# EasyEDA Pro project ProPrj_table-monitor_2025-05-22.epro, schematic Schematic2
Board Name: MipiBoard; Create Date: 2025-04-22; Page Name: P1; Project Name: table-monitor; Schematic Name: Schematic2; Update Date: 2025-04-25; Company: 嘉立创EDA; Page Size: A4; Version: V1.0
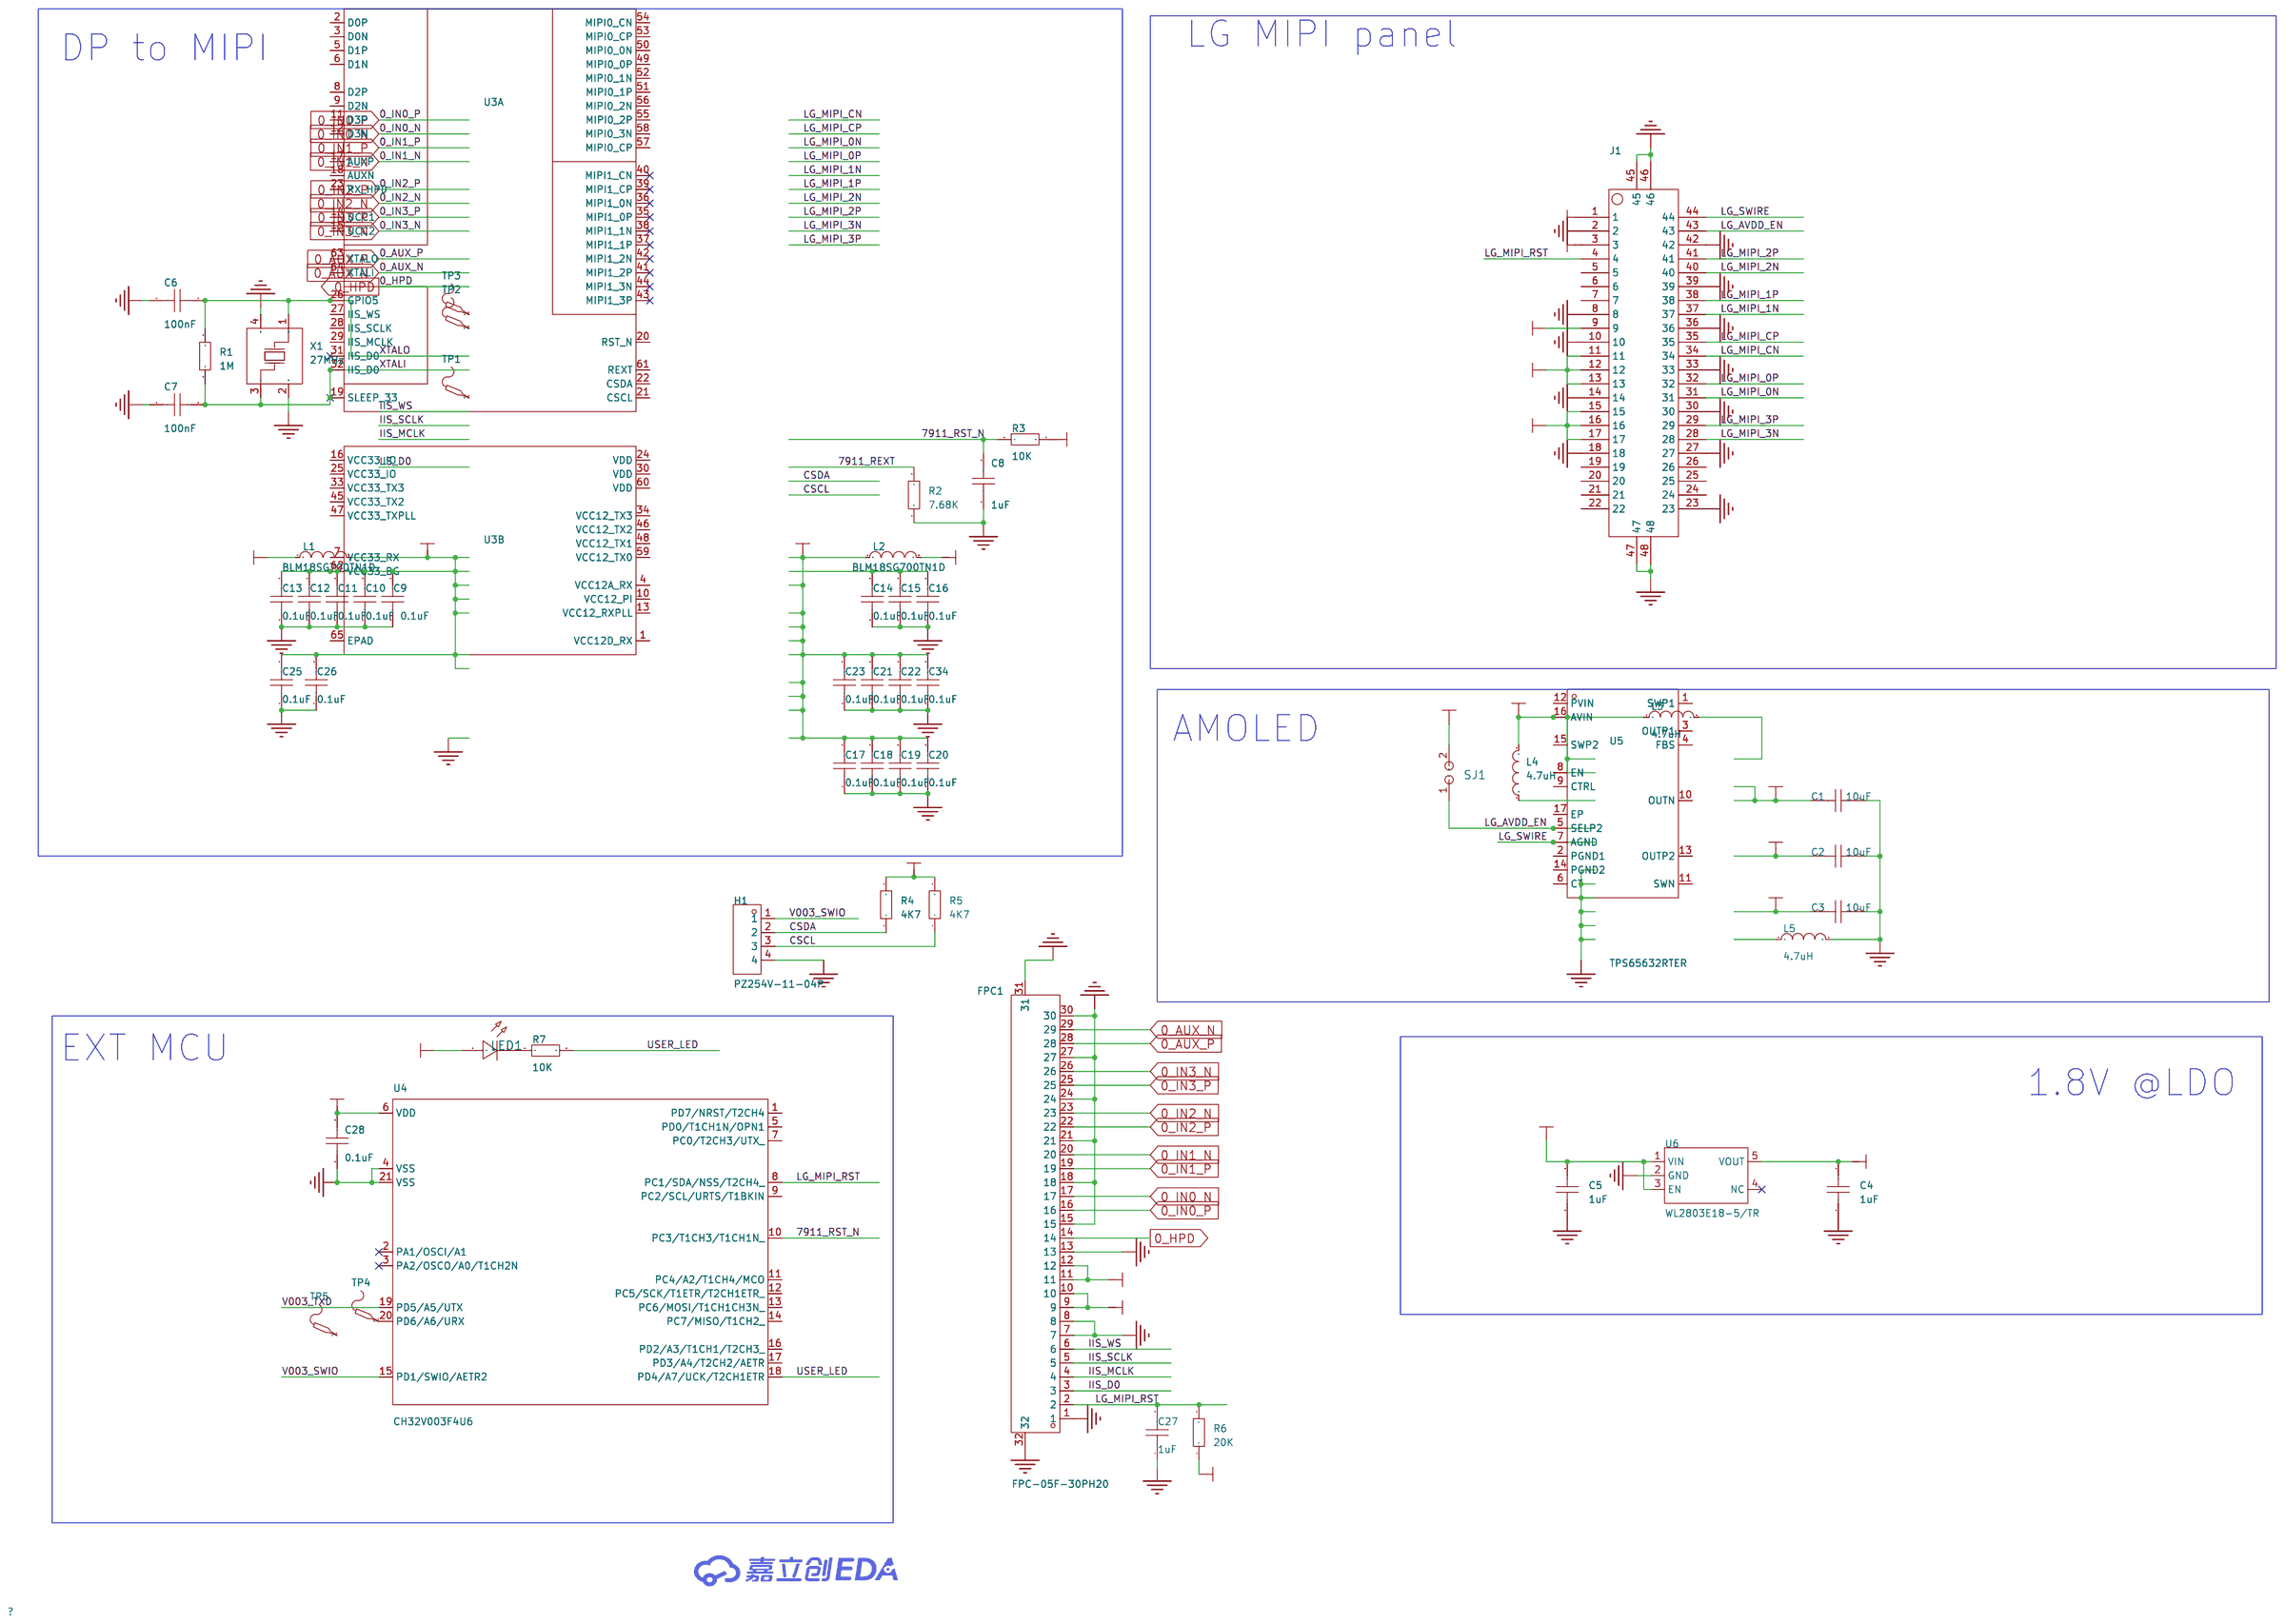
[diagram p0: schematic sheet]

## Parts
C1  10uF  [C0603]
C2  10uF  [C0603]
C3  10uF  [C0603]
C4  1uF  [C0603]
C5  1uF  [C0603]
C6  100nF  [C0603]
C7  100nF  [C0603]
C8  1uF  [C0603]
C9  0.1uF  [C0603]
C10  0.1uF  [C0603]
C11  0.1uF  [C0603]
C12  0.1uF  [C0603]
C13  0.1uF  [C0603]
C14  0.1uF  [C0603]
C15  0.1uF  [C0603]
C16  0.1uF  [C0603]
C17  0.1uF  [C0603]
C18  0.1uF  [C0603]
C19  0.1uF  [C0603]
C20  0.1uF  [C0603]
C21  0.1uF  [C0603]
C22  0.1uF  [C0603]
C23  0.1uF  [C0603]
C25  0.1uF  [C0603]
C26  0.1uF  [C0603]
C27  1uF  [C0603]
C28  0.1uF  [C0603]
C34  0.1uF  [C0603]
FPC1  FPC-05F-30PH20  [FPC-SMD_30P-P0.50_XUNPU_FPC-05F-30PH20]
H1  PZ254V-11-04P  [HDR-TH_4P-P2.54-V-M]
J1  -  [CONN-SMD_BM23PF0.8-44DS-0.35V]
L1  BLM18SG700TN1D  [L0603]
L2  BLM18SG700TN1D  [L0603]
L3  4.7uH  [IND-SMD_L2.5-W2.0]
L4  4.7uH  [IND-SMD_L2.5-W2.0]
L5  4.7uH  [IND-SMD_L2.5-W2.0]
LED1  -  [LED_0603]
R1  1M  [R0603]
R2  7.68K  [R0603]
R3  10K  [R0603]
R4  4K7  [R0603]
R5  4K7  [R0603]
R6  20K  [R0603]
R7  10K  [R0603]
SJ1  -  [TOGO_MODE]
TP1  -  [Test-Point-0.5mm]
TP2  -  [Test-Point-0.5mm]
TP3  -  [Test-Point-0.5mm]
TP4  -  [Test-Point-0.5mm]
TP5  -  [Test-Point-0.5mm]
U3  -  [QFN-64_L7.5-W7.5-P0.40]  (sections 1,2)
U4  CH32V003F4U6  [QFN-20_L3.0-W3.0-P0.40-TL-EP1.7]
U5  TPS65632RTER  [WQFN-16_L3.0-W3.0-P0.50-BL-EP1.7]
U6  WL2803E18-5/TR  [TSOT-23-5_L2.9-W1.6-P0.95-LS2.8-BR]
X1  27MHz  [OSC-SMD_4P-L3.2-W2.5-BL]

## Library data of the parts
C1-C23 C25-C28 C34 = CAP_0603: Supplier Footprint: 0603
FPC1 = FPC-05F-30PH20: 锁定特性:翻盖式;触点类型:下接;触点数量:30P;间距:0.5mm;安装类型:卧贴;工作温度范围:-25℃~+85℃;; LCSC Part Name: 间距:0.5mm P数:30P 翻盖式 下接; Supplier Part: C2856808; Manufacturer: XUNPU(讯普); Supplier Footprint: SMD,P=0.5mm,卧贴; JLCPCB Part Class: Extended Part; Datasheet: https://atta.szlcsc.com/upload/public/pdf/source/20210922/C2856808_4E6DDE2793CFD9EF09B771A8BD3338A4.pdf; Supplier: LCSC; Locking Feature: 翻盖式; Contact Type: 下接; Number of Contacts: 30P; Pitch: 0.5mm; Mounting Type: 卧贴; FFC, FCB Thickness: 0.3mm; Height Above Board: 2mm; Operating Temperature Range: -25℃~+85℃
H1 = PZ254V-11-04P: 插针结构:1x4P;间距:2.54mm;行距:-;圆针/方针:方针;安装类型:直插;排数:单排;总PIN位数:4P;额定电流:3A;额定电压:250V;配合针长度:6mm;塑高:2.5mm;端接针长度:3mm;触头材质:-;工作温度范围:-40℃~+105℃;颜色:黑色;; LCSC Part Name: 间距:2.54mm 1x4P 直插 方针; Supplier Part: C2691448; Manufacturer: XFCN(兴飞); Supplier Footprint: 插件,P=2.54mm; JLCPCB Part Class: 扩展库; Datasheet: https://atta.szlcsc.com/upload/public/pdf/source/20200309/C492403_F9F19131791D08044AD4F84F8E751A34.pdf; Supplier: LCSC; Pin Structure: 1x4P; Pitch: 2.54mm; Circluar Pins/Square Pins: 方针; Mounting Type: 直插; Number of Rows: 单排; Number of Pins: 4P; Current Rating (Max): 3A; Voltage Rating (Max): 250V; Length of Mating Pin: 6mm; Insulation Height: 2.5mm; Length of End Connection Pin: 3mm; Operating Temperature Range: -40℃~+105℃; Color: 黑色
J1 = BM23PF0.8-44DS-0.35V
L1 L2 = BLM18SG700TN1D: 标称阻抗@测试频率:70Ω@100MHz;误差:±25%;直流电阻(RDC):20mΩ;; LCSC Part Name: 单路 0603磁珠 阻抗70Ω@100MHz; Supplier Part: C113031; Manufacturer: muRata(村田); Supplier Footprint: 0603; JLCPCB Part Class: 扩展库; Datasheet: https://atta.szlcsc.com/upload/public/pdf/source/20170523/1495533956547.pdf; Supplier: LCSC; Impedance @ Frequency: 70Ω@100MHz; Tolerance: ±25%; DC Resistance: 20mΩ; Current Rating: 4A; Circuits: 1
L3-L5 = MCS25GD-4R7MMP: 电感值:4.7uH;精度:±20%;额定电流:1.4A;; LCSC Part Name: 4.7uH ±20%; Supplier Part: C443497; Manufacturer: PSA(信昌电陶); Supplier Footprint: SMD; JLCPCB Part Class: 扩展库; Datasheet: https://atta.szlcsc.com/upload/public/pdf/source/20191104/C443497_E5D87B1181E64B5D627F31A1536527C6.pdf; Supplier: LCSC; Tolerance: ±20%; Rated Current: 1.4A; DC Resistance (DCR): 196mΩ
LED1 = LED_0603-R: Supplier Footprint: 0603
R1-R7 = Res_0603: Supplier Footprint: 0603
SJ1 = JUMP跳接焊盘选择: Pin Type: IN
TP1-TP5 = Test-Point: Test Point 测试点
U3 = LT7911D
U4 = CH32V003F4U6: CPU内核:RISC-V;程序存储容量:16KB;RAM总容量:2KB;GPIO端口数量:18;工作电压范围:-;CPU最大主频:48MHz;程序存储器类型:-;应用领域:-;; Supplier Part: C5299908; Manufacturer: WCH(南京沁恒); Supplier Footprint: QFN-20(3X3); JLCPCB Part Class: Extended Part; Datasheet: https://atta.szlcsc.com/upload/public/pdf/source/20240313/77CE2EF5E2A3AF5A92256F1D84EF4244.pdf; Supplier: LCSC; CPU Core: RISC-V; Program Storage Size: 16KB; RAM Size: 2KB; GPIO Ports Number: 18; CPU Maximum Speed: 48MHz; UART/USART: 1; I2C: 1; SPI: 1; Watchdog: 有; Real-Time Clock: 有
U5 = TPS65632: Supplier Part: C2659312; Manufacturer: TI(德州仪器); Supplier Footprint: WQFN-16; JLCPCB Part Class: Extended Part; Datasheet: https://atta.szlcsc.comnull; Supplier: LCSC
U6 = WL2803E18-5/TR: 输出类型:固定;工作电压:5.5V;输出电压:1.8V;输出电流:-;电源纹波抑制比(PSRR):65dB@(1kHz)；58dB@(10kHz);输出极性:正极;; LCSC Part Name: 输入5.5V 输出1.8V; Supplier Part: C467850; Manufacturer: WILLSEMI(韦尔); Supplier Footprint: SOT-23-5L; JLCPCB Part Class: 扩展库; Datasheet: https://atta.szlcsc.com/upload/public/pdf/source/20191209/C467850_7EB67D2C8B50A7F5BE22250846E38DD9.pdf; Supplier: LCSC; Output Type: 固定; Voltage - Supply: 5.5V; Output Voltage: 1.8V; Power Supply Rejection Ratio (PSRR): 65dB@(1kHz)；58dB@(10kHz); Voltage Dropout: 230mV@(500mA); Features: 防静电保护；热保护(TSD)；过流保护(OCP)；带使能; Output Configuration: 正极; Number of Outputs: 1
X1 = X322527MSB4SI: 晶振类型:贴片晶振;频率:27MHz;常温频差:±10ppm;外接负载电容:20pF;频率稳定度(全温):±20ppm;; LCSC Part Name: 27MHz ±10ppm 20pF; Supplier Part: C9008; Manufacturer: YXC(扬兴晶振); Supplier Footprint: SMD3225-4P; JLCPCB Part Class: Extended Part; Datasheet: https://atta.szlcsc.com/upload/public/pdf/source/20240329/19D5F850207469550BEB00D7DFEDBC7A.pdf; Supplier: LCSC; Crystal Type: 贴片晶振; Normal temperature Frequency Tolerance: ±10ppm; External load capacitor: 20pF; Frequency Stability(Full temperature range): ±20ppm; Operating Temperature: -40℃~+85℃

## Nets
GND: C1.2 C2.2 C3.2 C4.1 C5.1 C6.1 C7.1 C8.1 C9.1 C10.1 C11.1 C12.1 C13.1 C14.1 C15.1 C16.1 C17.1 C18.1 C19.1 C20.1 C21.1 C22.1 C23.1 C25.1 C26.1 C27.1 C28.1 C34.1 FPC1.1 FPC1.7 FPC1.8 FPC1.13 FPC1.15 FPC1.18 FPC1.21 FPC1.24 FPC1.27 FPC1.30 FPC1.31 FPC1.32 H1.4 J1.2 J1.8 J1.10 J1.14 J1.18 J1.23 J1.27 J1.30 J1.33 J1.36 J1.39 J1.42 J1.45 J1.46 J1.47 J1.48 L5.2 R2.1 U4.4(VSS) U4.21(VSS) U6.2(GND) X1.2(GND) X1.4(GND)
V003_SWIO: H1.1 U4.15(PD1/SWIO/AETR2)
V003_TXD: U4.19(PD5/A5/UTX)
V33S: C5.2 C28.2 FPC1.11 FPC1.12 J1.1 L1.1 L3.1 L4.2 LED1.2(A) R3.2 R4.2 R5.2 R6.1 SJ1.2 U4.6(VDD) U5.16(AVIN) U6.1(VIN) U6.3(EN)
0_AUX_N: FPC1.29
0_AUX_P: FPC1.28
0_HPD: FPC1.14
0_IN0_N: FPC1.17
0_IN0_P: FPC1.16
0_IN1_N: FPC1.20
0_IN1_P: FPC1.19
0_IN2_N: FPC1.23
0_IN2_P: FPC1.22
0_IN3_N: FPC1.26
0_IN3_P: FPC1.25
7911_REXT: R2.2
7911_RST_N: C8.2 R3.1 U4.10(PC3/T1CH3/T1CH1N_)
7911_V12: FPC1.9 FPC1.10 L2.2
#7911_V3: C9.2 C10.2 C11.2 C12.2 C13.2 C25.2 C26.2 L1.2 U3.62(VCC33_BG)
#7911_V12: C17.2 C18.2 C19.2 C20.2 C21.2 C22.2 C23.2 C34.2 L2.1
CSCL: H1.3 R5.1
CSDA: H1.2 R4.1
IIS_D0: FPC1.3
IIS_MCLK: FPC1.4
IIS_SCLK: FPC1.5
IIS_WS: FPC1.6
LG_AVDD: C3.1 J1.9
LG_AVDD_EN: J1.43 SJ1.1 U5.5(SELP2)
LG_MIPI_0N: J1.31
LG_MIPI_0P: J1.32
LG_MIPI_1N: J1.37
LG_MIPI_1P: J1.38
LG_MIPI_2N: J1.40
LG_MIPI_2P: J1.41
LG_MIPI_3N: J1.28
LG_MIPI_3P: J1.29
LG_MIPI_CN: J1.34
LG_MIPI_CP: J1.35
LG_MIPI_RST: C27.2 FPC1.2 J1.4 R6.2 U4.8(PC1/SDA/NSS/T2CH4_)
LG_SWIRE: J1.44 U5.7(AGND)
LG_V18: C4.2 J1.3 U6.5(VOUT)
LG_VDD: C1.1 J1.11 J1.12 J1.13
LG_VSS: C2.1 J1.15 J1.16 J1.17
USER_LED: R7.2 U4.18(PD4/A7/UCK/T2CH1ETR)
XTALI: C7.2 R1.1 U3.19(SLEEP_33) U3.32(IIS_D0) X1.3(OSC2)
XTALO: C6.2 R1.2 U3.26(GPIO5) X1.1(OSC1)
Net-(C14-2): C14.2 C15.2 C16.2
Net-(LED1-1): LED1.1(C) R7.1
Net-(TP4-1): TP4.1 U4.20(PD6/A6/URX)

Not connected (* = marked no-connect by the designer): J1 5 6 7 19 20 21 22 24 25 26; L3 2; L4 1; L5 1; TP1 1; TP2 1; TP3 1; TP5 1; U3 1(VCC12D_RX) 2(D0P) 3(D0N) 4(VCC12A_RX) 5(D1P) 6(D1N) 7(VCC33_RX) 8(D2P) 9(D2N) 10(VCC12_PI) 11(D3P) 12(D3N) 13(VCC12_RXPLL) 14(UCC1) 15(UCC2) 16(VCC33_IO) 17(AUXP) 18(AUXN) 20(RST_N) 21(CSCL) 22(CSDA) 23(RX_HPD) 24(VDD) 25(VCC33_IO) 27(IIS_WS) 28(IIS_SCLK) 29(IIS_MCLK) 30(VDD) 31(IIS_D0)* 33(VCC33_TX3) 34(VCC12_TX3) 35(MIPI1_0P)* 36(MIPI1_0N)* 37(MIPI1_1P)* 38(MIPI1_1N)* 39(MIPI1_CP)* 40(MIPI1_CN)* 41(MIPI1_2P)* 42(MIPI1_2N)* 43(MIPI1_3P)* 44(MIPI1_3N)* 45(VCC33_TX2) 46(VCC12_TX2) 47(VCC33_TXPLL) 48(VCC12_TX1) 49(MIPI0_0P) 50(MIPI0_0N) 51(MIPI0_1P) 52(MIPI0_1N) 53(MIPI0_CP) 54(MIPI0_CN) 55(MIPI0_2P) 56(MIPI0_2N) 57(MIPI0_CP) 58(MIPI0_3N) 59(VCC12_TX0) 60(VDD) 61(REXT) 63(XTALO) 64(XTALI) 65(EPAD); U4 1(PD7/NRST/T2CH4) 2(PA1/OSCI/A1)* 3(PA2/OSCO/A0/T1CH2N)* 5(PD0/T1CH1N/OPN1) 7(PC0/T2CH3/UTX_) 9(PC2/SCL/URTS/T1BKIN) 11(PC4/A2/T1CH4/MCO) 12(PC5/SCK/T1ETR/T2CH1ETR_) 13(PC6/MOSI/T1CH1CH3N_) 14(PC7/MISO/T1CH2_) 16(PD2/A3/T1CH1/T2CH3_) 17(PD3/A4/T2CH2/AETR); U5 1(SWP1) 2(PGND1) 3(OUTP1) 4(FBS) 6(CT) 8(EN) 9(CTRL) 10(OUTN) 11(SWN) 12(PVIN) 13(OUTP2) 14(PGND2) 15(SWP2) 17(EP); U6 4(NC)*

## Notes on the sheet
- DP to MIPI
- LG MIPI panel
- AMOLED
- EXT MCU
- 1.8V @LDO
